# EAGLE design takahoot-controller (EAGLE 9.5.0)
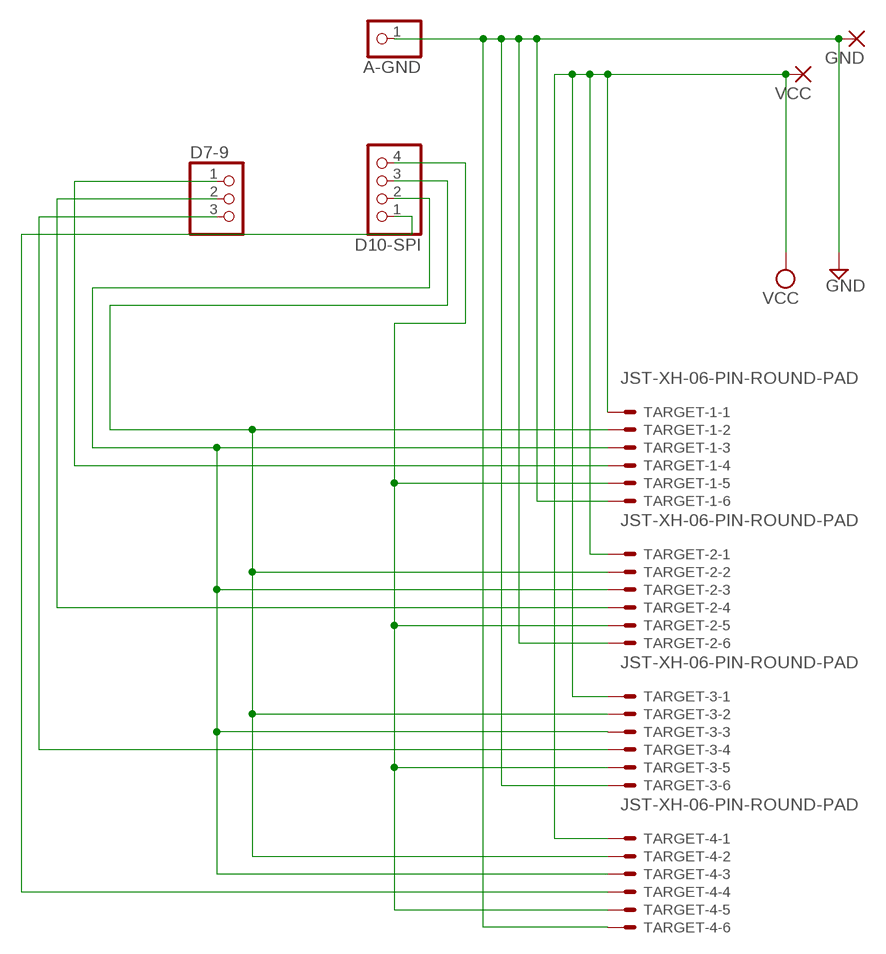
[diagram p0: schematic, sheet 1]

## Parts
A-GND  PINHD-1X1  [1X01]
D7-9  PINHD-1X3  [1X03]
D10-SPI  PINHD-1X4  [1X04]
GND  3,81/1,4  [3,81/1,4]
TARGET-1  JST-XH-06-PIN-ROUND-PAD  [JST-XH-06-PACKAGE-ROUND-PAD]
TARGET-2  JST-XH-06-PIN-ROUND-PAD  [JST-XH-06-PACKAGE-ROUND-PAD]
TARGET-3  JST-XH-06-PIN-ROUND-PAD  [JST-XH-06-PACKAGE-ROUND-PAD]
TARGET-4  JST-XH-06-PIN-ROUND-PAD  [JST-XH-06-PACKAGE-ROUND-PAD]
VCC  3,81/1,4  [3,81/1,4]

## Nets
GND: A-GND.1 GND.1(P) TARGET-1.6 TARGET-2.6 TARGET-3.6 TARGET-4.6
MISO: D10-SPI.3 TARGET-1.2 TARGET-2.2 TARGET-3.2 TARGET-4.2
MOSI: D10-SPI.2 TARGET-1.3 TARGET-2.3 TARGET-3.3 TARGET-4.3
SCK: D10-SPI.4 TARGET-1.5 TARGET-2.5 TARGET-3.5 TARGET-4.5
SS1: D7-9.1 TARGET-1.4
SS2: D7-9.2 TARGET-2.4
SS3: D7-9.3 TARGET-3.4
SS4: D10-SPI.1 TARGET-4.4
VCC: TARGET-1.1 TARGET-2.1 TARGET-3.1 TARGET-4.1 VCC.1(P)

## Library data of the parts
A-GND = pinhead:PINHD-1X1: PIN HEADER
D7-9 = pinhead:PINHD-1X3: PIN HEADER
D10-SPI = pinhead:PINHD-1X4: PIN HEADER
GND VCC = wirepad:3,81/1,4: THROUGH-HOLE PAD
TARGET-1-TARGET-4 = Rembrandt Electronics - JST XH Connectors v1-0:JST-XH-06-PIN: JST XH Connector 2 Pin Wire to board connector. Pitch: 2,54 mm, (0.100") Number of pins: 6 Created by Rembrandt Electronics www.rembrandtelectronics.com

## Board
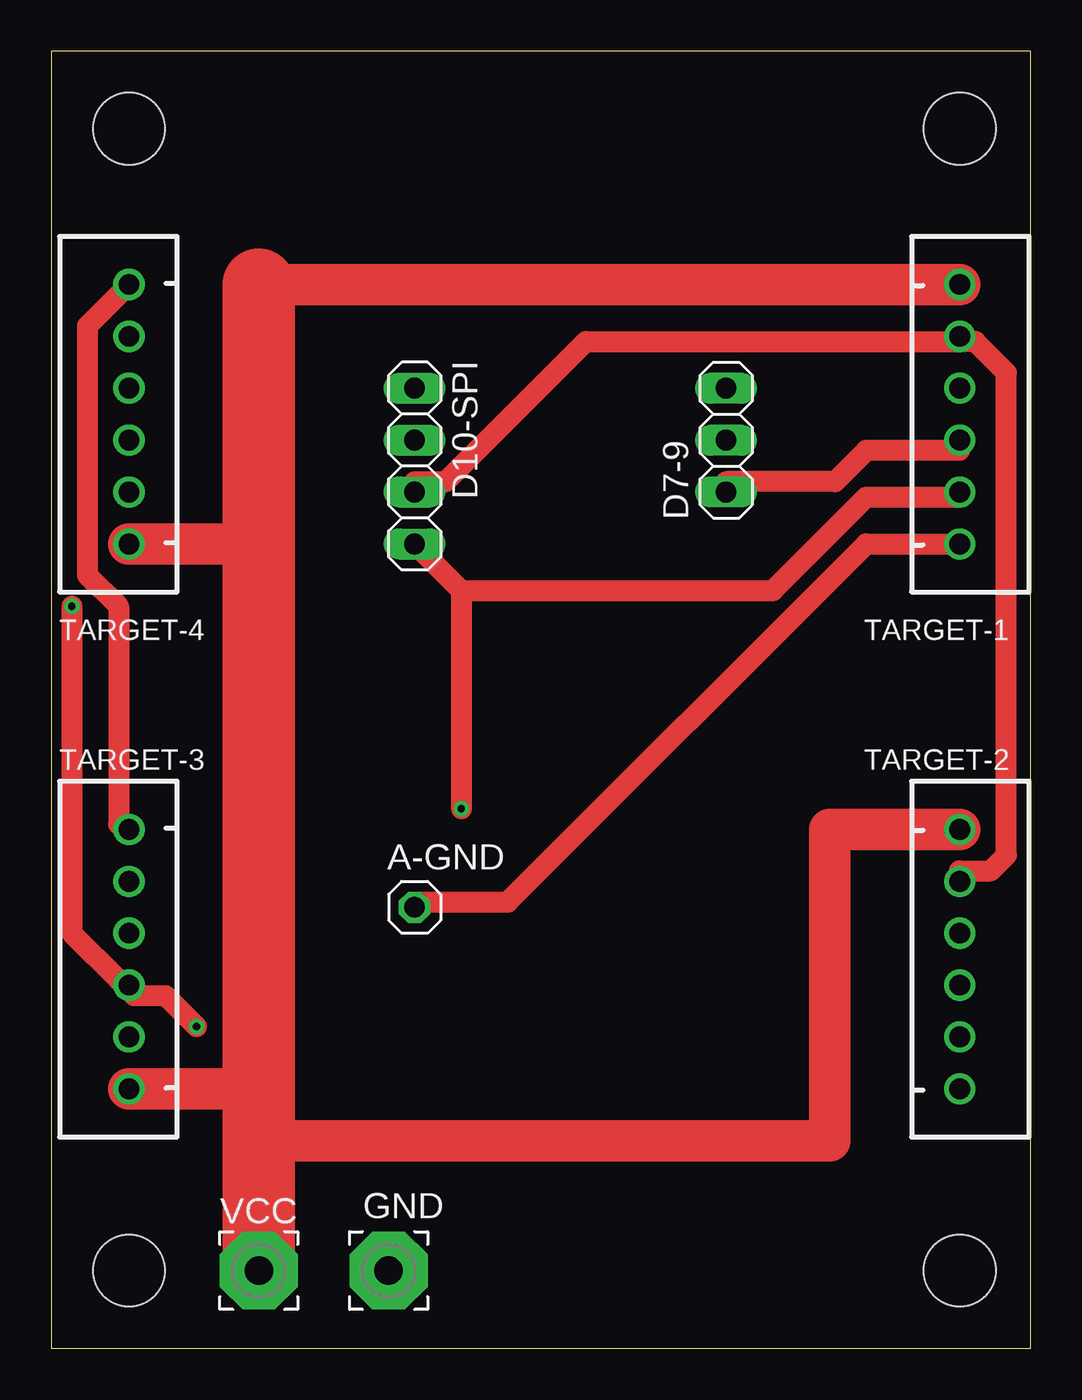
[diagram p1: board, top side]
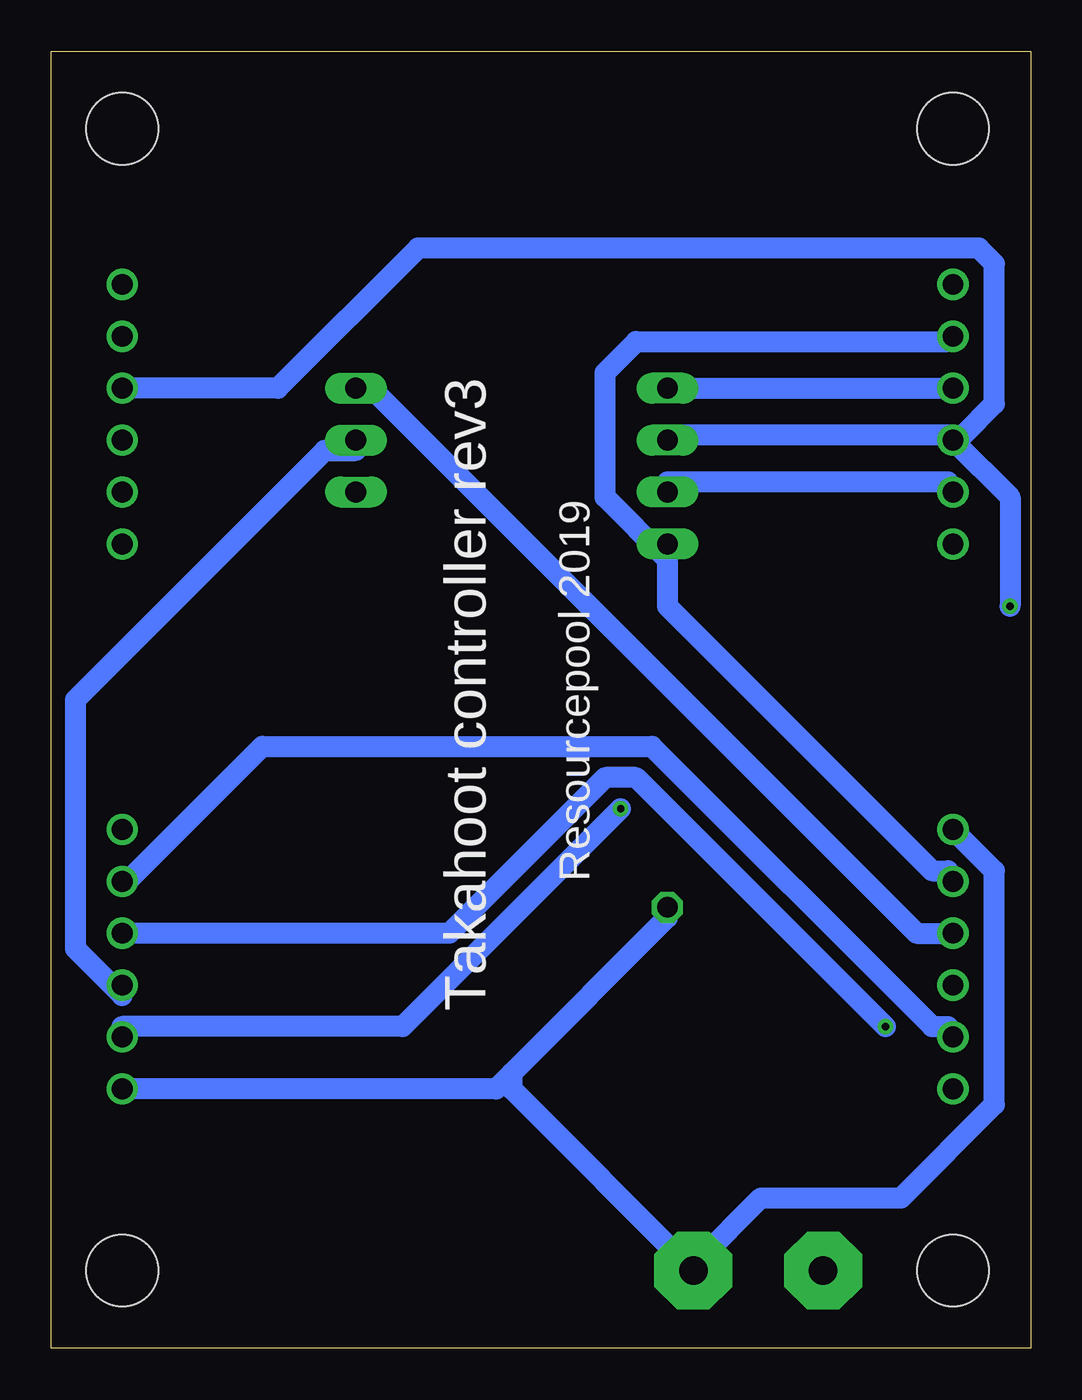
[diagram p2: board, bottom side, seen from below]

Size 47.93 x 63.49 mm. Coordinates in mm from the lower left corner, seen from the top.
Outline: 0,0 47.93,0 47.93,63.49 0,63.49 0,0
Copper layers (1*16): Top 0.035mm / dielectric 1.5mm / Bottom 0.035mm
Design rules "default *": minimum track width 40mil, minimum drill 0.35mm, track to track 20mil, track to pad 20mil, pad to pad 20mil, via to via 20mil, smd to smd 6mil, copper to edge 20mil, drill to drill 6mil, minimum pad ring 10mil, minimum via ring 8mil, stop-mask expansion 4mil, vias tented up to drill 0mil, thermal gap 10mil
Holes 3.51 mm at 44.45,3.81 44.45,59.69 3.81,3.81 3.81,59.69

### Footprints (pad centres in the part's own frame; a part is rotated, then mirrored left to right if it is on the bottom)
1X01 = drill 1.016 octagon: 1 0,0
1X03 = drill 1.016 long: 1 -2.54,0; 2 0,0; 3 2.54,0
1X04 = drill 1.016 long: 1 -3.81,0; 2 -1.27,0; 3 1.27,0; 4 3.81,0
3,81/1,4 = drill 1.397 pad 3.81 octagon: 1 0,0
JST-XH-06-PACKAGE-ROUND-PAD = drill 1.016: 1 -6.35,0; 2 -3.81,0; 3 -1.27,0; 4 1.27,0; 5 3.81,0; 6 6.35,0

### Placement (x,y rotation side)
A-GND  17.78,21.59 0 top
D7-9  33.02,44.45 90 top
D10-SPI  17.78,43.18 270 top
GND  16.51,3.81 0 top
TARGET-1  44.45,45.72 270 top
TARGET-2  44.45,19.05 270 top
TARGET-3  3.81,19.05 90 top
TARGET-4  3.81,45.72 90 top
VCC  10.16,3.81 0 top

### Tracks (layer width: path | path; a pad name or v marks a point on that pad's centre or on a via)
GND
  Top 1.016: 17.02,4.32 GND.1 | TARGET-4.6 1.78,50.04 1.78,37.85 3.3,36.32 3.3,25.65 TARGET-3.6 | TARGET-1.6 39.88,39.37 22.35,21.84 17.78,21.84 A-GND.1
  Bottom 1.016: TARGET-2.6 26.16,12.7 25.4,13.46 | 25.4,13.46 17.78,21.08 A-GND.1 | 25.4,13.46 25.4,12.7 GND.1 16.26,4.32 13.21,7.37 6.35,7.37 1.78,11.94 1.78,23.37 TARGET-3.6
MISO
  Top 1.016: 44.45,49.28 26.16,49.28 19.3,42.42 17.78,42.42 D10-SPI.3 | 44.45,49.28 45.21,49.28 46.74,47.75 46.74,24.13 45.97,23.37 44.45,23.37 TARGET-2.2 | 44.45,49.28 TARGET-1.2
  Bottom 1.016: TARGET-4.2 4.06,42.42 17.78,42.42 D10-SPI.3 | TARGET-3.2 4.06,15.75 4.83,15.75 18.54,29.46 37.59,29.46 44.45,22.61 TARGET-2.2
MOSI  (via drill 0.35)
  Top 1.016: v1.02,36.32 1.02,20.32 3.3,18.03 TARGET-3.3 4.06,17.27 5.59,17.27 v7.11,15.75
  Bottom 1.016: v1.02,36.32 1.02,41.66 TARGET-4.3 | D10-SPI.2 17.78,44.7 4.06,44.7 TARGET-4.3 | TARGET-2.3 28.45,20.32 20.83,27.94 19.3,27.94 v7.11,15.75 | TARGET-1.3 36.83,46.99 29.97,53.85 2.54,53.85 1.78,53.09 1.78,46.23 3.3,44.7 TARGET-4.3
SCK  (via drill 0.35)
  Top 1.016: 20.07,37.08 v20.07,26.42 | D10-SPI.4 20.07,37.08 | 20.07,37.08 35.31,37.08 39.88,41.66 44.45,41.66 TARGET-1.5
  Bottom 1.016: D10-SPI.4 17.78,38.61 | 17.78,38.61 17.78,36.32 4.83,23.37 4.06,23.37 TARGET-3.5 | 17.78,38.61 20.83,41.66 20.83,47.75 19.3,49.28 4.06,49.28 TARGET-4.5 | v20.07,26.42 30.73,15.75 44.45,15.75 TARGET-2.5
SS1
  Top 1.016: D7-9.1 33.02,42.42 38.35,42.42 39.88,43.94 44.45,43.94 TARGET-1.4
SS2
  Bottom 1.016: D7-9.2 33.02,43.94 34.54,43.94 46.74,31.75 46.74,19.56 44.45,17.27 TARGET-2.4
SS3
  Bottom 1.016: TARGET-3.4 5.59,20.32 32.26,46.99 D7-9.3
SS4
  Bottom 1.016: D10-SPI.1 TARGET-4.4
VCC
  Top 1.016: 10.16,12.7 10.16,10.16 VCC.1 10.16,39.37
  Top 2.032: TARGET-3.1 10.16,12.7 | 10.16,39.37 TARGET-4.1 | TARGET-1.1 10.16,52.07 | 10.16,10.16 38.1,10.16 38.1,25.4 TARGET-2.1
  Top 3.556: VCC.1 10.16,52.07

### Text on the board
tNames: GND
bNames: Resourcepool 2019 | Takahoot controller rev3